# EAGLE schematic stm32H7_board_rev8_144_16 (EAGLE 6.5.0)
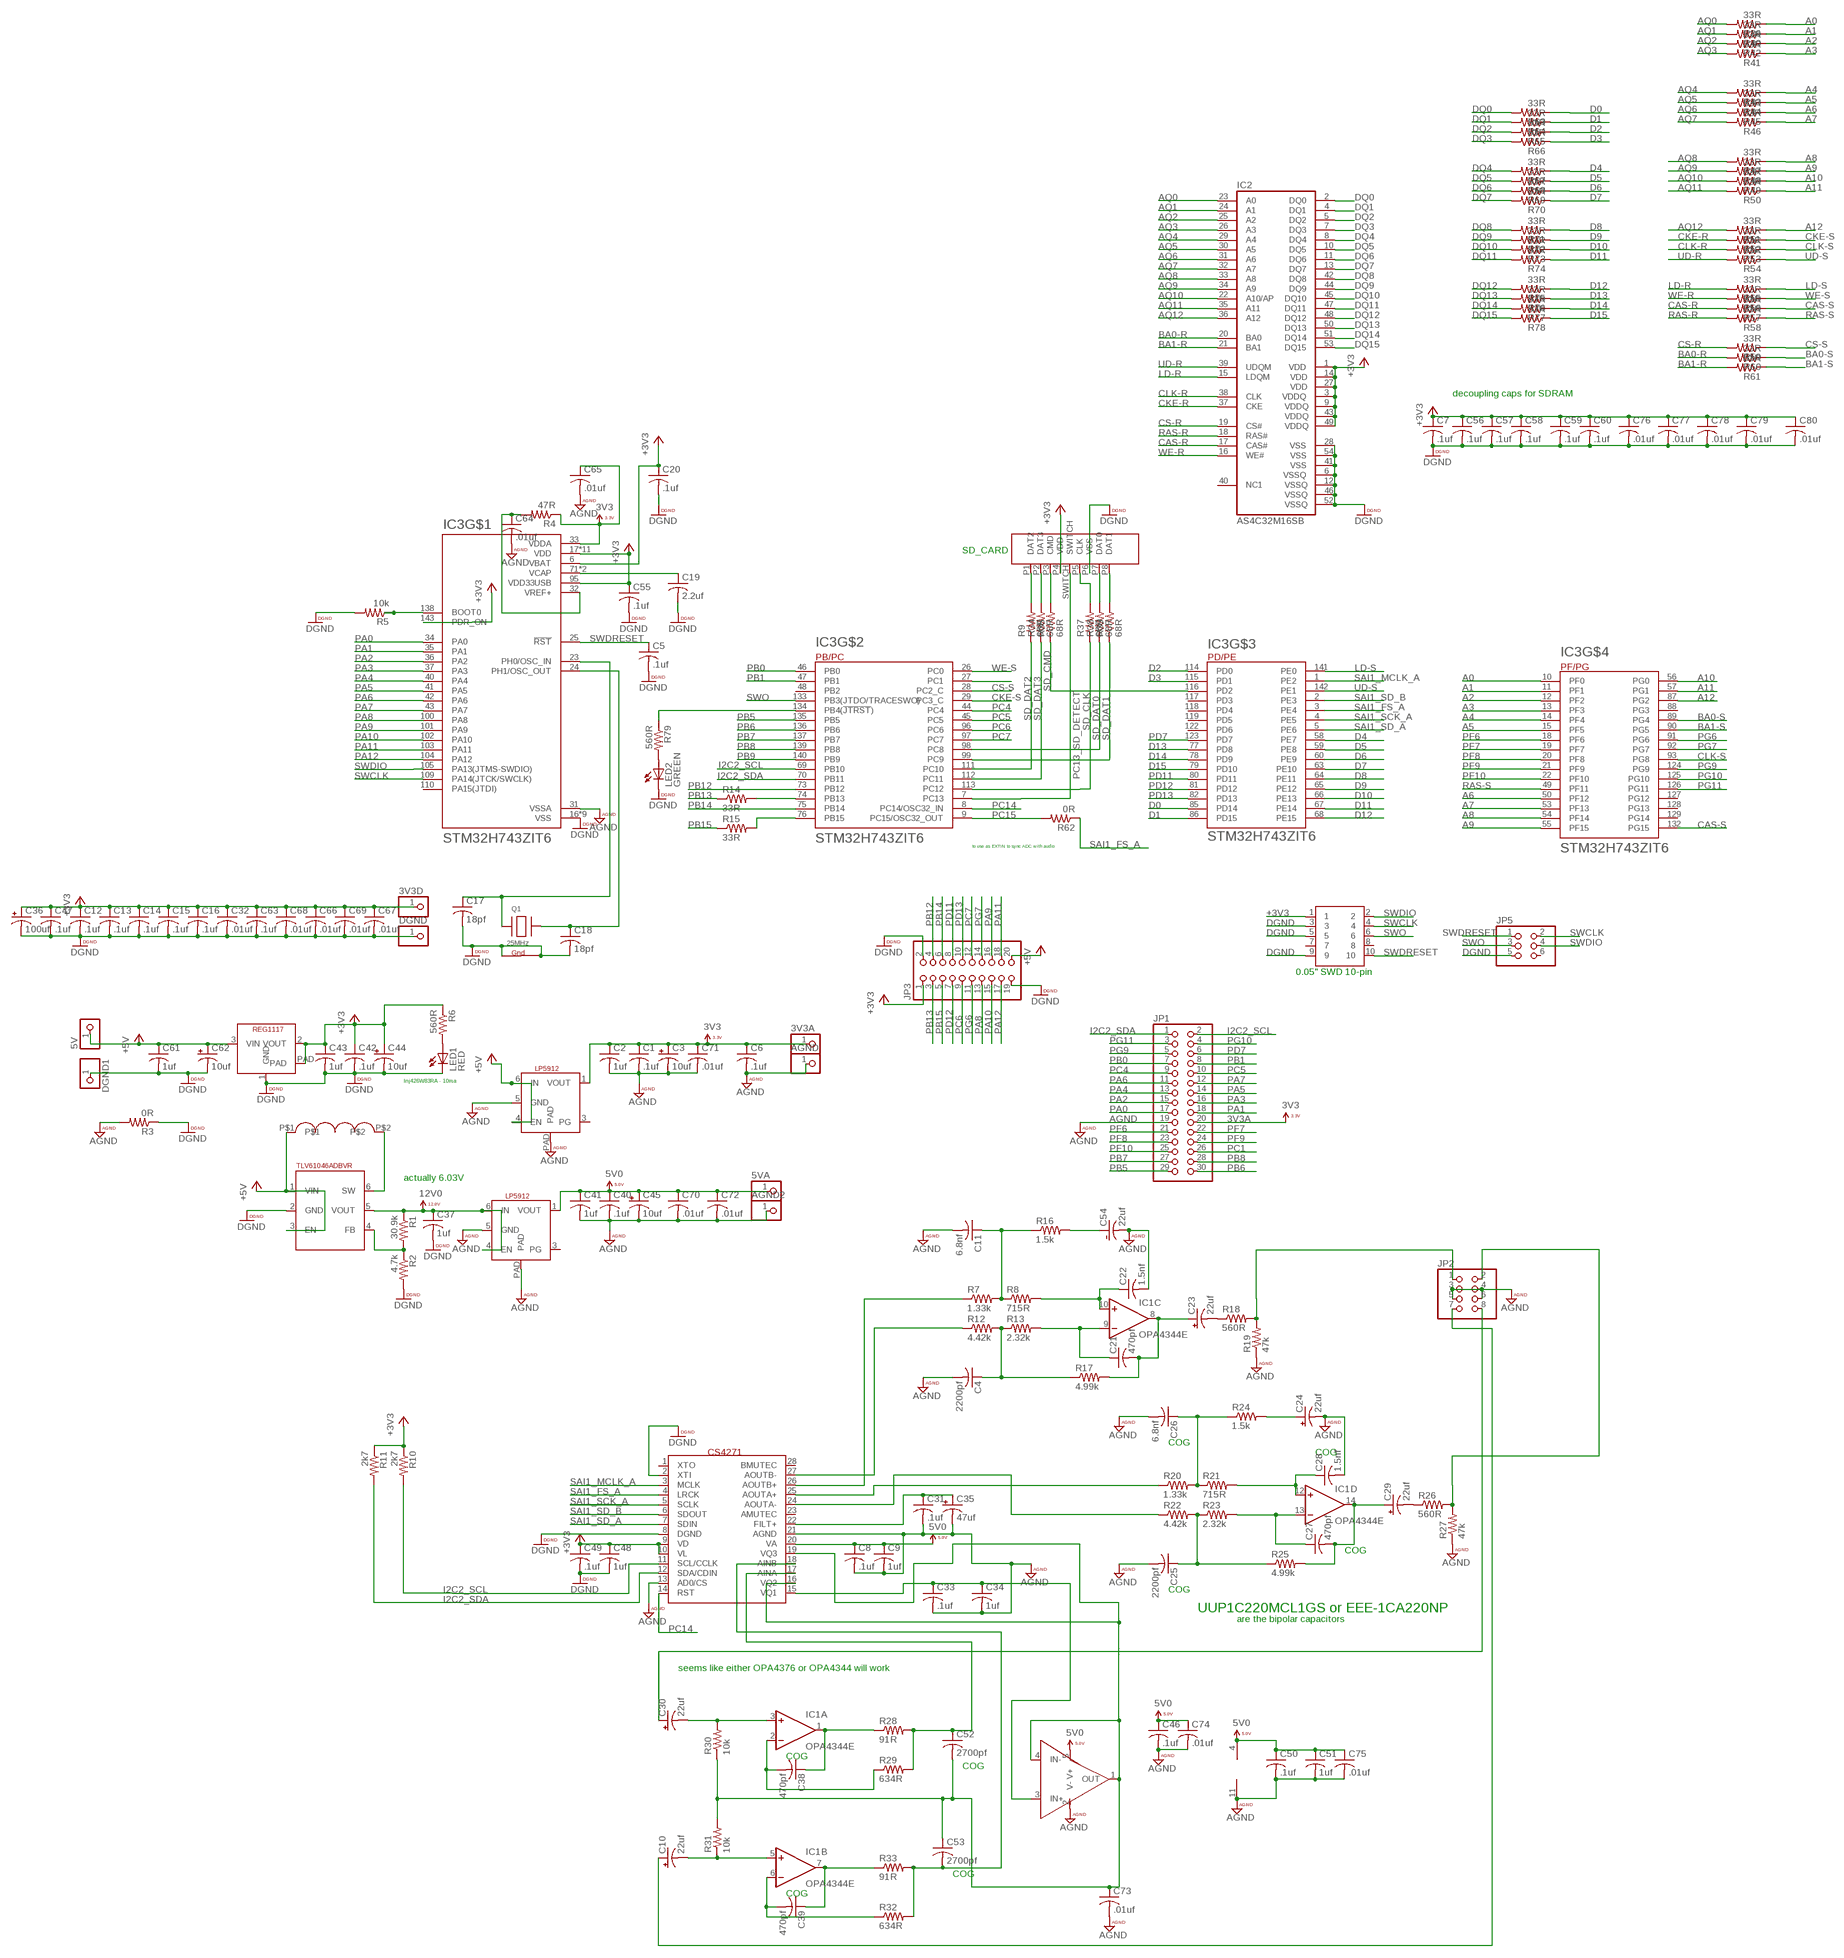
[diagram p0: schematic, sheet 1]

## Parts
3V3A  PINHD-1X1  [1X01]
3V3D  PINHD-1X1  [1X01]
5V  PINHD-1X1  [1X01]
5VA  PINHD-1X1  [1X01]
AGND  PINHD-1X1  [1X01]
AGND2  PINHD-1X1  [1X01]
C1  .1uf  C-USC0603  [C0603]
C2  1uf  C-USC1206  [C1206]
C3  10uf  CPOL-USSMCB  [SMC_B]
C4  2200pf  C-USC0603  [C0603]
C5  .1uf  C-USC0402  [C0402]
C6  .1uf  C-USC0402  [C0402]
C7  .1uf  C-USC0402  [C0402]
C8  .1uf  C-USC0603  [C0603]
C9  1uf  C-USC1206  [C1206]
C10  22uf  CPOL-USD  [PANASONIC_D]
C11  6.8nf  C-USC0603  [C0603]
C12  .1uf  C-USC0402  [C0402]
C13  .1uf  C-USC0402  [C0402]
C14  .1uf  C-USC0402  [C0402]
C15  .1uf  C-USC0402  [C0402]
C16  .1uf  C-USC0402  [C0402]
C17  18pf  C-USC0603  [C0603]
C18  18pf  C-USC0603  [C0603]
C19  2.2uf  C-USC1206  [C1206]
C20  .1uf  C-USC0402  [C0402]
C21  470pf  C-USC0603  [C0603]
C22  1.5nf  C-USC0603  [C0603]
C23  22uf  CPOL-USD  [PANASONIC_D]
C24  22uf  CPOL-USD  [PANASONIC_D]
C25  2200pf  C-USC0603  [C0603]
C26  6.8nf  C-USC0603  [C0603]
C27  470pf  C-USC0603  [C0603]
C28  1.5nf  C-USC0603  [C0603]
C29  22uf  CPOL-USD  [PANASONIC_D]
C30  22uf  CPOL-USD  [PANASONIC_D]
C31  .1uf  C-USC0603  [C0603]
C32  .01uf  C-USC0402  [C0402]
C33  .1uf  C-USC0603  [C0603]
C34  1uf  C-USC1206  [C1206]
C35  47uf  CPOL-USD  [PANASONIC_D]
C36  100uf  CPOL-USE  [PANASONIC_E]
C37  1uf  C-USC1206  [C1206]
C38  470pf  C-USC0603  [C0603]
C39  470pf  C-USC0603  [C0603]
C40  .1uf  C-USC0603  [C0603]
C41  1uf  C-USC1206  [C1206]
C42  .1uf  C-USC0603  [C0603]
C43  1uf  C-USC1206  [C1206]
C44  10uf  CPOL-USSMCB  [SMC_B]
C45  10uf  CPOL-USSMCB  [SMC_B]
C46  .1uf  C-USC0603  [C0603]
C47  .1uf  C-USC0402  [C0402]
C48  1uf  C-USC1206  [C1206]
C49  .1uf  C-USC0603  [C0603]
C50  .1uf  C-USC0603  [C0603]
C51  1uf  C-USC1206  [C1206]
C52  2700pf  C-USC0603  [C0603]
C53  2700pf  C-USC0603  [C0603]
C54  22uf  CPOL-USD  [PANASONIC_D]
C55  .1uf  C-USC0402  [C0402]
C56  .1uf  C-USC0402  [C0402]
C57  .1uf  C-USC0402  [C0402]
C58  .1uf  C-USC0402  [C0402]
C59  .1uf  C-USC0402  [C0402]
C60  .1uf  C-USC0402  [C0402]
C61  1uf  C-USC1206  [C1206]
C62  10uf  CPOL-USSMCB  [SMC_B]
C63  .1uf  C-USC0402  [C0402]
C64  .01uf  C-USC0402  [C0402]
C65  .01uf  C-USC0402  [C0402]
C66  .01uf  C-USC0201  [C0201]
C67  .01uf  C-USC0201  [C0201]
C68  .01uf  C-USC0201  [C0201]
C69  .01uf  C-USC0201  [C0201]
C70  .01uf  C-USC0201  [C0201]
C71  .01uf  C-USC0201  [C0201]
C72  .01uf  C-USC0201  [C0201]
C73  .01uf  C-USC0201  [C0201]
C74  .01uf  C-USC0201  [C0201]
C75  .01uf  C-USC0201  [C0201]
C76  .01uf  C-USC0201  [C0201]
C77  .01uf  C-USC0201  [C0201]
C78  .01uf  C-USC0201  [C0201]
C79  .01uf  C-USC0201  [C0201]
C80  .01uf  C-USC0201  [C0201]
DGND  PINHD-1X1  [1X01]
DGND1  PINHD-1X1  [1X01]
IC1  OPA4344E  [TSSOP14]
IC2  AS4C32M16SB  [TSOP54]
IC3  STM32H743ZIT6  [QFP50P2200X2200X160-144N]
IC4  REG1117  [SOT223]
IC5  CS4271  [TSSOP28]
IC6  TLV170  [SOT23-5L]
IC7  TLV61046ADBVR  [SOT23-6]
IC8  LP5912  [6-WSON]
IC9  LP5912  [6-WSON]
JP1  PINHD-2X15  [2X15]
JP2  PINHD-2X4  [2X04]
JP3  PINHD-2X10  [2X10]
JP5  PINHD-2X3  [2X03]
L1  74438336100  [1212]
LED1  RED  LEDCHIP-LED0603  [CHIP-LED0603]
LED2  GREEN  LEDCHIP-LED0603  [CHIP-LED0603]
Q1  25MHz  XTAL-4-3225  [NX3225]
R1  30.9k  R-US_R0603  [R0603]
R2  4.7k  R-US_R0603  [R0603]
R3  0R  R-US_R0603  [R0603]
R4  47R  R-US_R0603  [R0603]
R5  10k  R-US_R0402  [R0402]
R6  560R  R-US_R0603  [R0603]
R7  1.33k  R-US_R0603  [R0603]
R8  715R  R-US_R0603  [R0603]
R9  68R  R-US_R0201  [R0201]
R10  2k7  R-US_R0603  [R0603]
R11  2k7  R-US_R0603  [R0603]
R12  4.42k  R-US_R0603  [R0603]
R13  2.32k  R-US_R0603  [R0603]
R14  33R  R-US_R0402  [R0402]
R15  33R  R-US_R0402  [R0402]
R16  1.5k  R-US_R0603  [R0603]
R17  4.99k  R-US_R0603  [R0603]
R18  560R  R-US_R0603  [R0603]
R19  47k  R-US_R0603  [R0603]
R20  1.33k  R-US_R0603  [R0603]
R21  715R  R-US_R0603  [R0603]
R22  4.42k  R-US_R0603  [R0603]
R23  2.32k  R-US_R0603  [R0603]
R24  1.5k  R-US_R0603  [R0603]
R25  4.99k  R-US_R0603  [R0603]
R26  560R  R-US_R0603  [R0603]
R27  47k  R-US_R0603  [R0603]
R28  91R  R-US_R0603  [R0603]
R29  634R  R-US_R0603  [R0603]
R30  10k  R-US_R0603  [R0603]
R31  10k  R-US_R0603  [R0603]
R32  634R  R-US_R0603  [R0603]
R33  91R  R-US_R0603  [R0603]
R34  68R  R-US_R0201  [R0201]
R35  68R  R-US_R0201  [R0201]
R36  33R  R-US_R0201  [R0201]
R37  68R  R-US_R0201  [R0201]
R38  68R  R-US_R0201  [R0201]
R39  68R  R-US_R0201  [R0201]
R40  33R  R-US_R0201  [R0201]
R41  33R  R-US_R0201  [R0201]
R42  33R  R-US_R0201  [R0201]
R43  33R  R-US_R0201  [R0201]
R44  33R  R-US_R0201  [R0201]
R45  33R  R-US_R0201  [R0201]
R46  33R  R-US_R0201  [R0201]
R47  33R  R-US_R0201  [R0201]
R48  33R  R-US_R0201  [R0201]
R49  33R  R-US_R0201  [R0201]
R50  33R  R-US_R0201  [R0201]
R51  33R  R-US_R0201  [R0201]
R52  33R  R-US_R0201  [R0201]
R53  33R  R-US_R0201  [R0201]
R54  33R  R-US_R0201  [R0201]
R55  33R  R-US_R0201  [R0201]
R56  33R  R-US_R0201  [R0201]
R57  33R  R-US_R0201  [R0201]
R58  33R  R-US_R0201  [R0201]
R59  33R  R-US_R0201  [R0201]
R60  33R  R-US_R0201  [R0201]
R61  33R  R-US_R0201  [R0201]
R62  0R  R-US_R0603  [R0603]
R63  33R  R-US_R0201  [R0201]
R64  33R  R-US_R0201  [R0201]
R65  33R  R-US_R0201  [R0201]
R66  33R  R-US_R0201  [R0201]
R67  33R  R-US_R0201  [R0201]
R68  33R  R-US_R0201  [R0201]
R69  33R  R-US_R0201  [R0201]
R70  33R  R-US_R0201  [R0201]
R71  33R  R-US_R0201  [R0201]
R72  33R  R-US_R0201  [R0201]
R73  33R  R-US_R0201  [R0201]
R74  33R  R-US_R0201  [R0201]
R75  33R  R-US_R0201  [R0201]
R76  33R  R-US_R0201  [R0201]
R77  33R  R-US_R0201  [R0201]
R78  33R  R-US_R0201  [R0201]
R79  560R  R-US_R0603  [R0603]
X1  1050270001_SD_CARD_CONNECTOR  [1050270001]
X2  3221-10-0300-00  [3221-10-0300-00]

## Nets
3V3A: 3V3A.1 C1.1 C2.1 C3.+ C6.1 C65.1 C71.1 IC3.33(VDDA) IC9.1(VOUT) JP1.20 R4.1 ; supply symbol labelled 3V3
5V0: 5VA.1 C8.1 C9.1 C40.1 C41.1 C45.+ C46.1 C50.1 C51.1 C70.1 C72.1 C74.1 C75.1 IC1.4(P:V+) IC5.20(VA) IC6.5(V+) IC8.1(VOUT)
12V0: C37.1 IC7.5(VOUT) IC8.4(EN) IC8.6(IN) R1.1
+3V3: 3V3D.1 C7.1 C12.1 C13.1 C14.1 C15.1 C16.1 C20.1 C32.1 C36.+ C42.1 C43.1 C44.+ C47.1 C48.1 C49.1 C55.1 C56.1 C57.1 C58.1 C59.1 C60.1 C63.1 C66.1 C67.1 C68.1 C69.1 C76.1 C77.1 C78.1 C79.1 C80.1 IC2.1(VDD) IC2.3(VDDQ) IC2.9(VDDQ) IC2.14(VDD) IC2.27(VDD) IC2.43(VDDQ) IC2.49(VDDQ) IC3.6(VBAT) IC3.17(VDD) IC3.30(VDD) IC3.39(VDD) IC3.52(VDD) IC3.62(VDD) IC3.72(VDD) IC3.84(VDD) IC3.95(VDD33USB) IC3.108(VDD) IC3.121(VDD) IC3.131(VDD) IC3.143(PDR_ON) IC3.144(VDD) IC4.2(VOUT) IC4.PAD IC5.9(VD) IC5.10(VL) JP3.1 R6.1 R10.1 R11.1 X1.P4(VDD) X2.1
+5V: 5V.1 C61.1 C62.+ IC4.3(VIN) IC7.1(VIN) IC7.3(EN) IC9.4(EN) IC9.6(IN) JP3.20 L1.P$1
A0: IC3.10(PF0) R36.1
A1: IC3.11(PF1) R40.1
A2: IC3.12(PF2) R42.1
A3: IC3.13(PF3) R41.1
A4: IC3.14(PF4) R43.1
A5: IC3.15(PF5) R44.1
A6: IC3.50(PF12) R45.1
A7: IC3.53(PF13) R46.1
A8: IC3.54(PF14) R47.1
A9: IC3.55(PF15) R48.1
A10: IC3.56(PG0) R49.1
A11: IC3.57(PG1) R50.1
A12: IC3.87(PG2) R51.1
AGND: AGND2.1 AGND.1 C1.2 C2.2 C3.- C4.2 C6.2 C8.2 C9.2 C11.2 C22.2 C24.- C25.2 C26.2 C28.2 C31.2 C33.2 C34.2 C35.- C40.2 C41.2 C45.- C46.2 C50.2 C51.2 C54.- C64.2 C65.2 C70.2 C71.2 C72.2 C73.2 C74.2 C75.2 IC1.11(P:V-) IC3.31(VSSA) IC5.13(AD0/CS) IC5.21(AGND) IC6.2(V-) IC8.5(GND) IC8.PAD IC9.5(GND) IC9.PAD JP1.19 JP2.3 JP2.4 JP2.5 JP2.6 R3.2 R19.1 R27.1
AQ0: IC2.23(A0) R36.2
AQ1: IC2.24(A1) R40.2
AQ2: IC2.25(A2) R42.2
AQ3: IC2.26(A3) R41.2
AQ4: IC2.29(A4) R43.2
AQ5: IC2.30(A5) R44.2
AQ6: IC2.31(A6) R45.2
AQ7: IC2.32(A7) R46.2
AQ8: IC2.33(A8) R47.2
AQ9: IC2.34(A9) R48.2
AQ10: IC2.22(A10/AP) R49.2
AQ11: IC2.35(A11) R50.2
AQ12: IC2.36(A12) R51.2
BA0-R: IC2.20(BA0) R60.2
BA0-S: IC3.89(PG4) R60.1
BA1-R: IC2.21(BA1) R61.2
BA1-S: IC3.90(PG5) R61.1
CAS-R: IC2.17(CAS#) R57.2
CAS-S: IC3.132(PG15) R57.1
CKE-R: IC2.37(CKE) R52.2
CKE-S: IC3.29(PC3_C) R52.1
CLK-R: IC2.38(CLK) R53.2
CLK-S: IC3.93(PG8) R53.1
CS-R: IC2.19(CS#) R59.2
CS-S: IC3.28(PC2_C) R59.1
D0: IC3.85(PD14) R63.1
D1: IC3.86(PD15) R64.1
D2: IC3.114(PD0) R65.1
D3: IC3.115(PD1) R66.1
D4: IC3.58(PE7) R67.1
D5: IC3.59(PE8) R68.1
D6: IC3.60(PE9) R69.1
D7: IC3.63(PE10) R70.1
D8: IC3.64(PE11) R71.1
D9: IC3.65(PE12) R72.1
D10: IC3.66(PE13) R73.1
D11: IC3.67(PE14) R74.1
D12: IC3.68(PE15) R75.1
D13: IC3.77(PD8) R76.1
D14: IC3.78(PD9) R77.1
D15: IC3.79(PD10) R78.1
DGND: C5.2 C7.2 C12.2 C13.2 C14.2 C15.2 C16.2 C17.2 C18.2 C19.2 C20.2 C32.2 C36.- C37.2 C42.2 C43.2 C44.- C47.2 C48.2 C49.2 C55.2 C56.2 C57.2 C58.2 C59.2 C60.2 C61.2 C62.- C63.2 C66.2 C67.2 C68.2 C69.2 C76.2 C77.2 C78.2 C79.2 C80.2 DGND1.1 DGND.1 IC2.6(VSSQ) IC2.12(VSSQ) IC2.28(VSS) IC2.41(VSS) IC2.46(VSSQ) IC2.52(VSSQ) IC2.54(VSS) IC3.16(VSS) IC3.38(VSS) IC3.51(VSS) IC3.61(VSS) IC3.83(VSS) IC3.94(VSS) IC3.107(VSS) IC3.120(VSS) IC3.130(VSS) IC4.1(GND) IC5.2(XTI) IC5.8(DGND) IC7.2(GND) JP3.2 JP3.19 JP5.5 LED1.C LED2.C Q1.2(G2) Q1.4(G1) R2.2 R3.1 R5.2 X1.P6(VSS) X2.3 X2.5 X2.9
DQ0: IC2.2(DQ0) R63.2
DQ1: IC2.4(DQ1) R64.2
DQ2: IC2.5(DQ2) R65.2
DQ3: IC2.7(DQ3) R66.2
DQ4: IC2.8(DQ4) R67.2
DQ5: IC2.10(DQ5) R68.2
DQ6: IC2.11(DQ6) R69.2
DQ7: IC2.13(DQ7) R70.2
DQ8: IC2.42(DQ8) R71.2
DQ9: IC2.44(DQ9) R72.2
DQ10: IC2.45(DQ10) R73.2
DQ11: IC2.47(DQ11) R74.2
DQ12: IC2.48(DQ12) R75.2
DQ13: IC2.50(DQ13) R76.2
DQ14: IC2.51(DQ14) R77.2
DQ15: IC2.53(DQ15) R78.2
FB: IC7.4(FB) R1.2 R2.1
FILT_A: C31.1 C35.+ IC5.22(FILT+)
I2C2_SCL: IC3.69(PB10) IC5.11(SCL/CCLK) JP1.2 R10.2
I2C2_SDA: IC3.70(PB11) IC5.12(SDA/CDIN) JP1.1 R11.2
LD-R: IC2.15(LDQM) R55.2
LD-S: IC3.141(PE0) R55.1
N$2: IC5.24(AOUTA-) R22.1
N$3: IC3.74(PB13) R14.2
N$4: IC3.76(PB15) R15.2
N$5: LED2.A R79.2
N$6: IC3.134(PB4(!JTRST!)) R79.1
N$7: C39.1 IC1.7(B:OUT) R33.1
N$9: R35.2 X1.P3(CMD)
N$10: R34.2 X1.P2(DAT3)
N$11: R9.2 X1.P1(DAT2)
N$12: R39.2 X1.P8(DAT1)
N$14: C11.1 R7.2 R8.1 R16.1
N$15: R38.2 X1.P7(DAT0)
N$16: R37.2 X1.P5(CLK)
N$44: IC3.138(BOOT0) R5.1
N$45: LED1.A R6.2
N$48: IC5.25(AOUTA+) R20.1
N$49: IC5.26(AOUTB+) R7.1
N$50: C22.1 IC1.10(C:+IN) R8.2
N$51: C21.1 IC1.9(C:-IN) R13.2
N$54: IC5.27(AOUTB-) R12.1
N$55: JP2.1 R18.2 R19.2
N$56: C23.- R18.1
N$57: C4.1 R12.2 R13.1 R17.1
N$58: C21.2 C23.+ IC1.8(C:OUT) R17.2
N$59: C54.+ R16.2
N$60: C28.1 IC1.12(D:+IN) R21.2
N$61: C27.1 IC1.13(D:-IN) R23.2
N$62: JP2.2 R26.2 R27.2
N$63: C29.- R26.1
N$64: C25.1 R22.2 R23.1 R25.1
N$65: C27.2 C29.+ IC1.14(D:OUT) R25.2
N$66: C26.1 R20.2 R21.1 R24.1
N$67: C24.+ R24.2
N$68: C52.2 C53.1 C73.1 IC5.16(VQ2) IC5.19(VQ3) IC6.1(OUT) IC6.4(IN-) R30.1 R31.2
N$69: C30.+ JP2.8
N$70: C10.+ JP2.7
N$71: C30.- IC1.3(A:+IN) R30.2
N$72: C10.- IC1.5(B:+IN) R31.1
N$74: C38.2 IC1.2(A:-IN) R29.1
N$75: C38.1 IC1.1(A:OUT) R28.1
N$76: C39.2 IC1.6(B:-IN) R32.1
N$78: C52.1 IC5.17(AINA) R28.2 R29.2
N$79: C53.2 IC5.18(AINB) R32.2 R33.2
OSC1: C17.1 IC3.23(PH0/OSC_IN) Q1.1(X1)
OSC2: C18.1 IC3.24(PH1/OSC_OUT) Q1.3(X2)
PA0: IC3.34(PA0) JP1.17
PA1: IC3.35(PA1) JP1.18
PA2: IC3.36(PA2) JP1.15
PA3: IC3.37(PA3) JP1.16
PA4: IC3.40(PA4) JP1.13
PA5: IC3.41(PA5) JP1.14
PA6: IC3.42(PA6) JP1.11
PA7: IC3.43(PA7) JP1.12
PA8: IC3.100(PA8) JP3.13
PA9: IC3.101(PA9) JP3.16
PA10: IC3.102(PA10) JP3.15
PA11: IC3.103(PA11) JP3.18
PA12: IC3.104(PA12) JP3.17
PB0: IC3.46(PB0) JP1.7
PB1: IC3.47(PB1) JP1.8
PB5: IC3.135(PB5) JP1.29
PB6: IC3.136(PB6) JP1.30
PB7: IC3.137(PB7) JP1.27
PB8: IC3.139(PB8) JP1.28
PB9: IC3.140(PB9)
PB12: IC3.73(PB12) JP3.4
PB13: JP3.3 R14.1
PB14: IC3.75(PB14) JP3.6
PB15: JP3.5 R15.1
PC1: IC3.27(PC1) JP1.26
PC4: IC3.44(PC4) JP1.9
PC5: IC3.45(PC5) JP1.10
PC6: IC3.96(PC6) JP3.9
PC7: IC3.97(PC7) JP3.12
PC13_SD_DETECT: IC3.7(PC13) X1.SWITCH
PC14: IC3.8(PC14/OSC32_IN) IC5.14(RST)
PC15: IC3.9(PC15/OSC32_OUT) R62.2
PD7: IC3.123(PD7) JP1.6
PD11: IC3.80(PD11) JP3.8
PD12: IC3.81(PD12) JP3.7
PD13: IC3.82(PD13) JP3.10
PF6: IC3.18(PF6) JP1.21
PF7: IC3.19(PF7) JP1.22
PF8: IC3.20(PF8) JP1.23
PF9: IC3.21(PF9) JP1.24
PF10: IC3.22(PF10) JP1.25
PG6: IC3.91(PG6) JP3.11
PG7: IC3.92(PG7) JP3.14
PG9: IC3.124(PG9) JP1.5
PG10: IC3.125(PG10) JP1.4
PG11: IC3.126(PG11) JP1.3
RAS-R: IC2.18(RAS#) R58.2
RAS-S: IC3.49(PF11) R58.1
SAI1_FS_A: IC3.3(PE4) IC5.4(LRCK) R62.1
SAI1_MCLK_A: IC3.1(PE2) IC5.3(MCLK)
SAI1_SCK_A: IC3.4(PE5) IC5.5(SCLK)
SAI1_SD_A: IC3.5(PE6) IC5.7(SDIN)
SAI1_SD_B: IC3.2(PE3) IC5.6(SDOUT)
SD_CLK: IC3.113(PC12) R37.1
SD_CMD: IC3.116(PD2) R35.1
SD_DAT0: IC3.98(PC8) R38.1
SD_DAT1: IC3.99(PC9) R39.1
SD_DAT2: IC3.111(PC10) R9.1
SD_DAT3: IC3.112(PC11) R34.1
SW: IC7.6(SW) L1.P$2
SWCLK: IC3.109(PA14(JTCK/SWCLK)) JP5.2 X2.4
SWDIO: IC3.105(PA13(JTMS-SWDIO)) JP5.4 X2.2
SWDRESET: C5.1 IC3.25(!RST) JP5.1 X2.10
SWO: IC3.133(PB3(JTDO/TRACESWO)) JP5.3 X2.6
UD-R: IC2.39(UDQM) R54.2
UD-S: IC3.142(PE1) R54.1
VCAP: C19.1 IC3.71(VCAP) IC3.106(VCAP)
VQ: C33.1 C34.1 IC5.15(VQ1) IC6.3(IN+)
VREF: C64.1 IC3.32(VREF+) R4.2
WE-R: IC2.16(WE#) R56.2
WE-S: IC3.26(PC0) R56.1
Unconnected: IC2.40(NC1) IC3.48(PB2) IC3.88(PG3) IC3.110(PA15(JTDI)) IC3.117(PD3) IC3.118(PD4) IC3.119(PD5) IC3.122(PD6) IC3.127(PG12) IC3.128(PG13) IC3.129(PG14) IC5.1(XTO) IC5.23(AMUTEC) IC5.28(BMUTEC) IC8.3(PG) IC9.3(PG) JP5.6 X2.7 X2.8

## Notes on the sheet
- decoupling caps for SDRAM
- SD_CARD
- to use as EXTIN to sync ADC with audio
- 0.05" SWD 10-pin
- lnj426W83RA - 10ma
- actually 6.03V
- COG
- COG
- COG
- COG
- UUP1C220MCL1GS or EEE-1CA220NP
- are the bipolar capacitors
- seems like either OPA4376 or OPA4344 will work
- COG
- COG
- COG
- COG

## Library data of the parts
3V3A 3V3D 5V 5VA AGND AGND2 DGND DGND1 = adafruit:PINHD-1X1: Pin header 1x1 for 0.1" spacing With round pins; PARTNO: *DNP
C1 C8 C31 C33 C40 C42 C46 C49 C50 = rcl:C-US: CAPACITOR, American symbol; PARTNO: CC0603KRX7R8BB104
C2 C9 C34 C37 C41 C43 C48 C51 C61 = rcl:C-US: CAPACITOR, American symbol; PARTNO: C3216X7R1E105K085AA
C3 C44 C45 C62 = rcl:CPOL-US: POLARIZED CAPACITOR, American symbol; PARTNO: TAJB106K025RNJ
C4 C25 = rcl:C-US: CAPACITOR, American symbol; PARTNO: CC0603JRNPO9BN221
C5-C7 C12-C16 C20 C47 C55-C60 C63 = rcl:C-US: CAPACITOR, American symbol; PARTNO: CC0402KRX7R8BB104
C10 C23 C24 C29 C30 C54 = adafruit:CPOL-US: POLARIZED CAPACITOR, American symbol; PARTNO: EEE-1CA220NP
C11 C26 = rcl:C-US: CAPACITOR, American symbol; PARTNO: C0603C682J5GACTU
C17 C18 = rcl:C-US: CAPACITOR, American symbol; PARTNO: CL10C180JB8NNNC
C19 = adafruit:C-US: CAPACITOR, American symbol; PARTNO: T491A225K020AT
C21 C27 C38 C39 = rcl:C-US: CAPACITOR, American symbol; PARTNO: CC0603JRNPO9BN471
C22 C28 = rcl:C-US: CAPACITOR, American symbol; PARTNO: C0603C152J5GACTU
C32 C64 C65 = rcl:C-US: CAPACITOR, American symbol; PARTNO: CC0402KRX7R8BB103
C35 = adafruit:CPOL-US: POLARIZED CAPACITOR, American symbol; PARTNO: EEE-1CA470AP
C36 = adafruit:CPOL-US: POLARIZED CAPACITOR, American symbol; PARTNO: EEE-1CA101AP
C52 C53 = rcl:C-US: CAPACITOR, American symbol; PARTNO: C0603C272J5GACTU
C66-C80 = rcl:C-US: CAPACITOR, American symbol; PARTNO: TMK063B7103KP-F
IC1 = linear:OPA4*: Quad Operational Amplifier compatible with: TLC27L4 Low Power, Single-Supply, Rail-To-Rail Operational Amplifier Source: http://focus.ti.com/lit/ds/symlink/opa2345.pdf http://focus.ti.com .. opa241.pdf http://focus.ti.com .. tlc27l4.pdf http://focus.ti.com/lit/ds/symlink/opa2134.pdf; PARTNO: ADA4807-4ARUZ-R7
IC2 = sdram:AS4C32M16SB; PARTNO: AS4C16M16SA-7TCN
IC3 = STM32H743ZIT6:STM32H743ZIT6: High-performance and DSP with DP-FPU, ARM Cortex-M7 MCU with 2MBytes Flash, 1MB RAM, 400 MHz CPU, Art Accelerator, L1...; AVAILABILITY: Unavailable; DESCRIPTION: High-performance and DSP with DP-FPU, ARM Cortex-M7 MCU with 2MBytes Flash, 1MB RAM, 400 MHz CPU, Art Accelerator, L1...; MF: STMicroelectronics; MP: STM32H743ZIT6; PACKAGE: LQFP-144 STMicroelectronics; PARTNO: STM32H743ZIT6; PRICE: None
IC4 = custom:REG1117; PARTNO: LM1117IMPX-3.3/NOPB
IC5 = custom:CS4271; PARTNO: CS4271-CZZ
IC6 = custom:TLV170; PARTNO: TLV170IDBVT
IC7 = custom:TLV61046ADBVR; PARTNO: TLV61046ADBVR
IC8 = custom:LP5912; PARTNO: LP5912-5.0DRVR
IC9 = custom:LP5912; PARTNO: LP5912-3.3DRVT
JP1 = pinhead:PINHD-2X15: PIN HEADER; PARTNO: 76342-315LF
JP2 = pinhead:PINHD-2X4: PIN HEADER; PARTNO: 76342-304LF
JP3 = SparkFun-Connectors:PINHD-2X10: PIN HEADER; PARTNO: 76342-310LF
JP5 = pinhead:PINHD-2X3: PIN HEADER; PARTNO: *DNP
L1 = custom:74438336100; PARTNO: 74438336100
LED1 = adafruit:LED: LED OSRAM: - CHIPLED LG R971, LG N971, LY N971, LG Q971, LY Q971, LO R971, LY R971 LH N974, LH R974 LS Q976, LO Q976, LY Q976 LO Q996 - Hyper CHIPLED LW Q18S LB Q993, LB Q99A, LB R99A - SideLED LS A670, LO A670, LY A670, LG A670, LP A670 LB A673, LV A673, LT A673, LW A673 LH A674 LY A675 LS A676, LA A676, LO A676, LY A676, LW A676 LS A679, LY A679, LG A679 - Hyper Micro SIDELED® LS Y876, LA Y876, LO Y876, LY Y876 LT Y87S - SmartLED LW L88C, LW L88S LB L89C, LB L89S, LG L890 LS L89K, LO L89K, LY L89K LS L896, LA L896, LO L896, LY L896 - TOPLED LS T670, LO T670, LY T670, LG T670, LP T670 LSG T670, LSP T670, LSY T670, LOP T670, LYG T670 LG T671, LOG T671, LSG T671 LB T673, LV T673, LT T673, LW T673 LH T674 LS T676, LA T676, LO T676, LY T676, LB T676, LH T676, LSB T676, LW T676 LB T67C, LV T67C, LT T67C, LS T67K, LO T67K, LY T67K, LW E67C LS E67B, LA E67B, LO E67B, LY E67B, LB E67C, LV E67C, LT E67C LW T67C LS T679, LY T679, LG T679 LS T770, LO T770, LY T770, LG T770, LP T770 LB T773, LV T773, LT T773, LW T773 LH T774 LS E675, LA E675, LY E675, LS T675 LS T776, LA T776, LO T776, LY T776, LB T776 LHGB T686 LT T68C, LB T68C - Hyper Mini TOPLED® LB M676 - Mini TOPLED Santana® LG M470 LS M47K, LO M47K, LY M47K Source: http://www.osram.convergy.de/; PARTNO: 5973006507F
LED2 = adafruit:LED: LED OSRAM: - CHIPLED LG R971, LG N971, LY N971, LG Q971, LY Q971, LO R971, LY R971 LH N974, LH R974 LS Q976, LO Q976, LY Q976 LO Q996 - Hyper CHIPLED LW Q18S LB Q993, LB Q99A, LB R99A - SideLED LS A670, LO A670, LY A670, LG A670, LP A670 LB A673, LV A673, LT A673, LW A673 LH A674 LY A675 LS A676, LA A676, LO A676, LY A676, LW A676 LS A679, LY A679, LG A679 - Hyper Micro SIDELED® LS Y876, LA Y876, LO Y876, LY Y876 LT Y87S - SmartLED LW L88C, LW L88S LB L89C, LB L89S, LG L890 LS L89K, LO L89K, LY L89K LS L896, LA L896, LO L896, LY L896 - TOPLED LS T670, LO T670, LY T670, LG T670, LP T670 LSG T670, LSP T670, LSY T670, LOP T670, LYG T670 LG T671, LOG T671, LSG T671 LB T673, LV T673, LT T673, LW T673 LH T674 LS T676, LA T676, LO T676, LY T676, LB T676, LH T676, LSB T676, LW T676 LB T67C, LV T67C, LT T67C, LS T67K, LO T67K, LY T67K, LW E67C LS E67B, LA E67B, LO E67B, LY E67B, LB E67C, LV E67C, LT E67C LW T67C LS T679, LY T679, LG T679 LS T770, LO T770, LY T770, LG T770, LP T770 LB T773, LV T773, LT T773, LW T773 LH T774 LS E675, LA E675, LY E675, LS T675 LS T776, LA T776, LO T776, LY T776, LB T776 LHGB T686 LT T68C, LB T68C - Hyper Mini TOPLED® LB M676 - Mini TOPLED Santana® LG M470 LS M47K, LO M47K, LY M47K Source: http://www.osram.convergy.de/; PARTNO: 5973506507F
Q1 = adafruit:XTAL-4: Classic 4-pin 3.2 x 2.5mm crystal; PARTNO: 7M-25.000MAAJ-T
R1 = resistor:R-US_: RESISTOR, American symbol; PARTNO: RT0603BRD0730K9L
R2 = resistor:R-US_: RESISTOR, American symbol; PARTNO: CRCW06034K70FKEAHP
R3 R62 = resistor:R-US_: RESISTOR, American symbol; PARTNO: RCS06030000Z0EA
R4 = resistor:R-US_: RESISTOR, American symbol; PARTNO: ESR03EZPJ470
R5 = resistor:R-US_: RESISTOR, American symbol; PARTNO: RC0402FR-0710KL
R6 R18 R26 R79 = resistor:R-US_: RESISTOR, American symbol; PARTNO: ESR03EZPF5600
R7 R20 = resistor:R-US_: RESISTOR, American symbol; PARTNO: RT0603BRD071K33L
R8 R21 = resistor:R-US_: RESISTOR, American symbol; PARTNO: RC0603FR-07715RL
R9 R34 R35 R37-R39 = rcl:R-US_: RESISTOR, American symbol; PARTNO: RC0201FR-0768RL
R10 R11 = resistor:R-US_: RESISTOR, American symbol; PARTNO: RT0603BRD072K7L
R12 R22 = resistor:R-US_: RESISTOR, American symbol; PARTNO: RT0603BRD074K42L
R13 R23 = resistor:R-US_: RESISTOR, American symbol; PARTNO: RT0603BRD072K32L
R14 R15 = resistor:R-US_: RESISTOR, American symbol; PARTNO: RC0402FR-0733RL
R16 R24 = resistor:R-US_: RESISTOR, American symbol; PARTNO: ESR03EZPJ152
R17 R25 = resistor:R-US_: RESISTOR, American symbol; PARTNO: RT0603BRD074K99L
R19 R27 = resistor:R-US_: RESISTOR, American symbol; PARTNO: ESR03EZPJ473
R28 R33 = resistor:R-US_: RESISTOR, American symbol; PARTNO: RC0603JR-0791RL
R29 R32 = resistor:R-US_: RESISTOR, American symbol; PARTNO: RC0603FR-07634RL
R30 R31 = resistor:R-US_: RESISTOR, American symbol; PARTNO: ESR03EZPF1002
R36 R40-R61 R63-R78 = rcl:R-US_: RESISTOR, American symbol; PARTNO: RC0201FR-0733RL
X1 = custom:1050270001_SD_CARD_CONNECTOR; PARTNO: 1050270001
X2 = custom:3221-10-0300-00; PARTNO: 3221-10-0300-00